# Altium schematic sheet ESP32_Schem_V2.SchDoc (part 4 of 4)
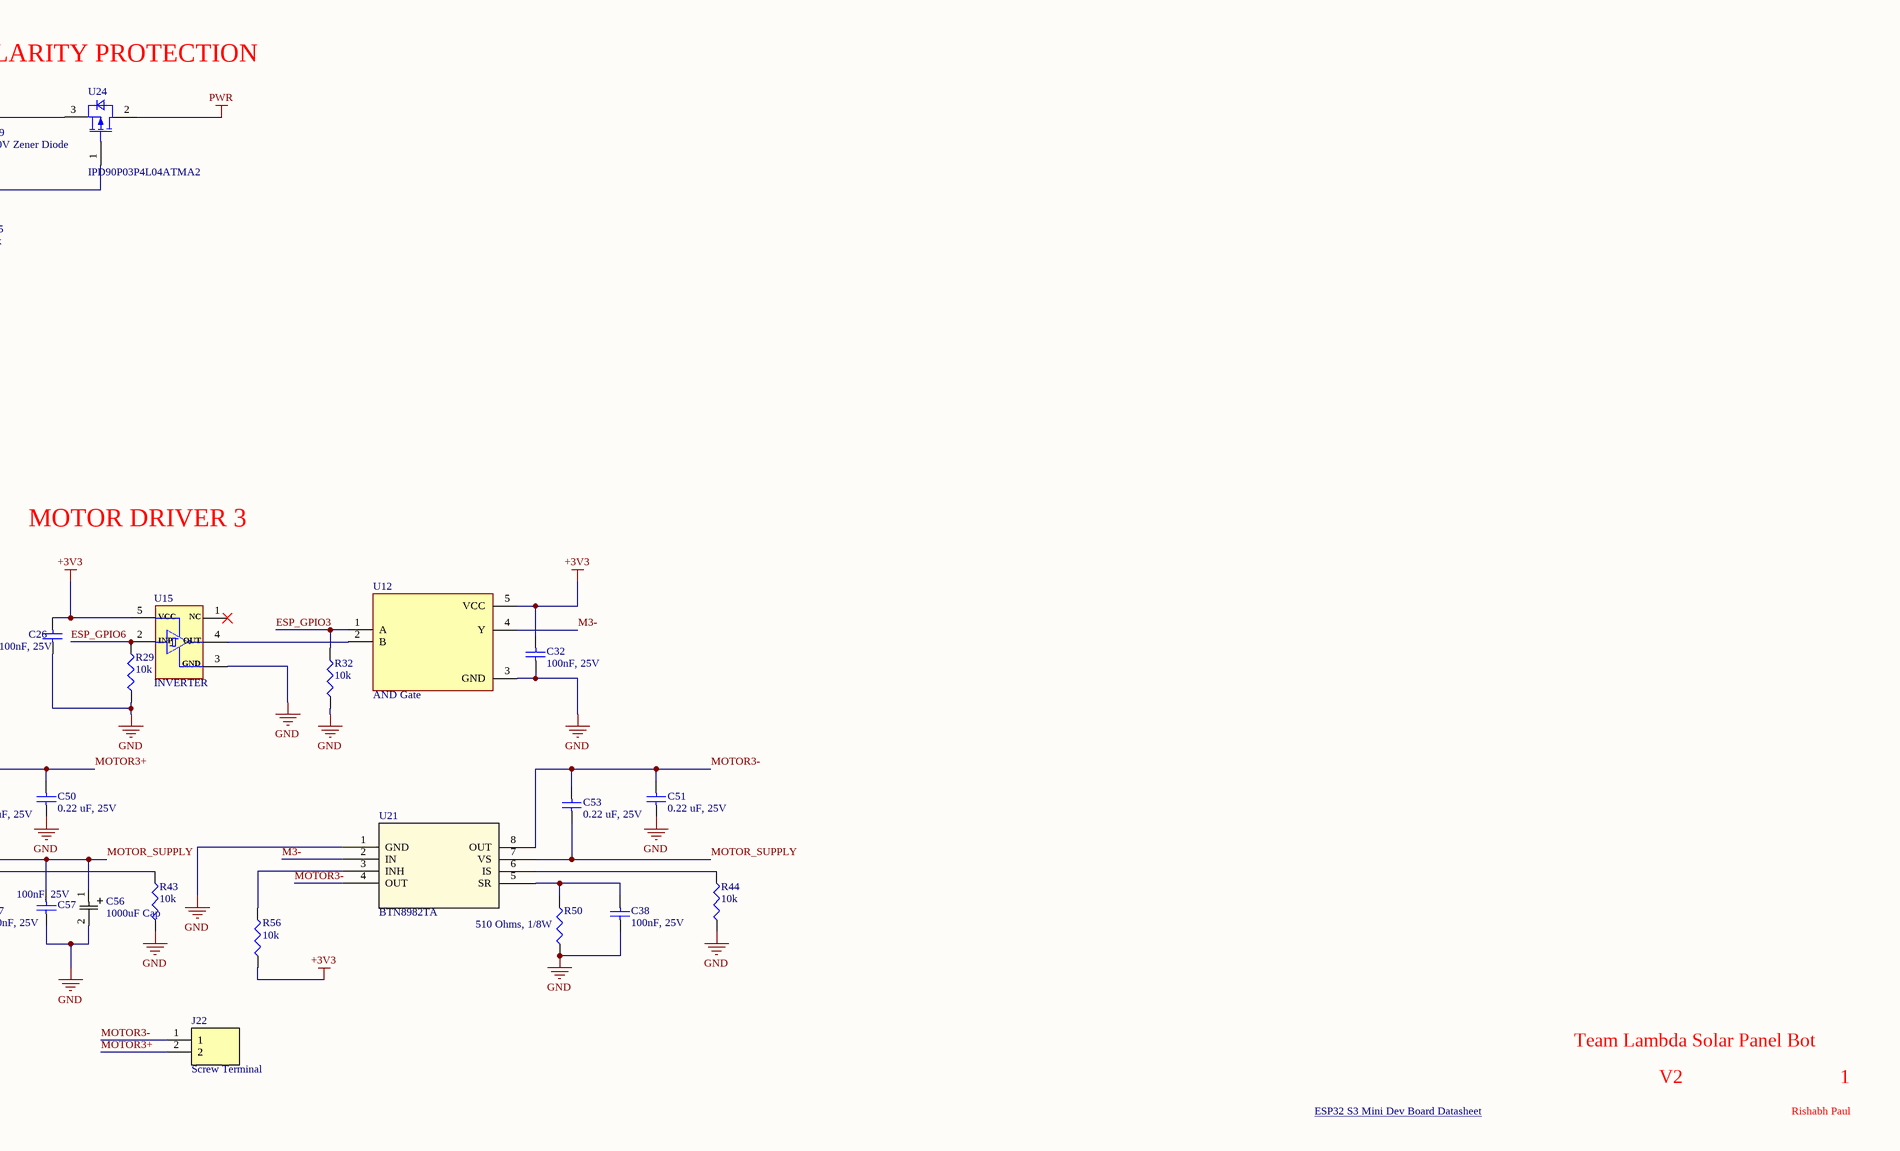
[diagram p6: ESP32_Schem_V2.SchDoc, bottom right]

## Library data of the parts (continued)
R23 R24 = AC0402FR-075K1L: Fixed Resistor, Metal Glaze/thick Film, 0.0625W, 5100ohm, 50V, 1% +/-Tol, 100ppm/Cel, Surface Mount, 0402; Manufacturer: Yageo; Additional Feature: LASER TRIMMABLE; Power: 62.5mW; Rated Temperature: 70°C; Value: 5.1kR; Temperature Coefficient (ppm/Cel): 100; Package Height: 0.32mm; Package Length: 1mm; Package Width: 0.5mm; Reference Standard: AEC-Q200; Supplier: Digikey; Supplier Part Number: YAG3503CT-ND; Manufacturer Part Number: AC0402FR-075K1L; RoHS: Yes; Category: Chip SMD Resistors; Stock: 61301; Pricing: 1=0.1, 10=0.009, 100=0.0071, 1000=0.00612, 2500=0.0051, 10000=0.00204 (USD); Mounting Technology: Surface Mount; Pins: 2; Package Shape: Rectangular; Case/Package: 0402; Terminal Finish: Nickel; Min Operating Temperature: -55°C; Max Operating Temperature: 155°C; Tolerance: 1%; JESD-609 Code: e3; Resistor Type: FIXED RESISTOR; Construction: Chip; Packaging: Tape and Reel; Technology: METAL GLAZE/THICK FILM; Termination: Wraparound; Working Voltage: 50V; Reach SVHC Compliant: Yes; RoHS Compliant: Yes; ComponentLink1URL: https://datasheet.ciiva.com:443/pdfs/VipMasterIC/IC/YAGO/YAGO-S-A0003597364/YAGO-S-A0003597364-1.pdf?src-supplier=IHS+Markit; ComponentLink1Description: https://datasheet.ciiva.com:443/pdfs/VipMasterIC/IC/YAGO/YAGO-S-A0003597364/YAGO-S-A0003597364-1.pdf?src-supplier=IHS+Markit; ComponentLink2URL: https://datasheet.octopart.com/AC0402FR-075K1L-Yageo-datasheet-166720450.pdf?src-supplier=Future+Electronics; ComponentLink2Description: https://datasheet.octopart.com/AC0402FR-075K1L-Yageo-datasheet-166720450.pdf?src-supplier=Future+Electronics; ComponentLink3URL: http://www.yageo.com/documents/recent/PYu-AC_51_RoHS_L_2_revised.pdf?src-supplier=Future+Electronics; ComponentLink3Description: http://www.yageo.com/documents/recent/PYu-AC_51_RoHS_L_2_revised.pdf?src-supplier=Future+Electronics; ComponentLink4URL: http://www.yageo.com/NewPortal/yageodocoutput?fileName=/pdf/R-Chip/PYu-AC_51_RoHS_L_6.pdf&src-supplier=Digikey; ComponentLink4Description: http://www.yageo.com/NewPortal/yageodocoutput?fileName=/pdf/R-Chip/PYu-AC_51_RoHS_L_6.pdf&src-supplier=Digikey; ComponentLink5URL: https://datasheet.octopart.com/AC0402FR-075K1L-Yageo-datasheet-178509465.pdf?src-supplier=Newark; ComponentLink5Description: https://datasheet.octopart.com/AC0402FR-075K1L-Yageo-datasheet-178509465.pdf?src-supplier=Newark; ComponentLink6URL: https://datasheet.octopart.com/AC0402FR-075K1L-Yageo-datasheet-178509465.pdf?src-supplier=Farnell; ComponentLink6Description: https://datasheet.octopart.com/AC0402FR-075K1L-Yageo-datasheet-178509465.pdf?src-supplier=Farnell; ComponentLink7URL: https://datasheet.octopart.com/AC0402FR-075K1L-Yageo-datasheet-178509465.pdf?src-supplier=Element14; ComponentLink7Description: https://datasheet.octopart.com/AC0402FR-075K1L-Yageo-datasheet-178509465.pdf?src-supplier=Element14; LCSC Part Number: C144745
R25 R27-R44 R51-R56 = RC0402FR-0710KP: RES 10K OHM 1% 1/16W 0402; Manufacturer: Yageo; Additional Feature: LASER TRIMMABLE; Power: 62.5mW; Rated Temperature: 70°C; Value: 10kR; Working Voltage: 50V; Temperature Coefficient (ppm/Cel): 150; Supplier: Digikey; Supplier Part Number: YAG1249CT-ND; Manufacturer Part Number: RC0402FR-0710KP; RoHS: Yes; Category: Chip SMD Resistors; Stock: 883590; Pricing: 1=0.11, 10=0.014, 100=0.0112, 1000=0.00918, 2500=0.00714 (USD); Mounting Technology: Surface Mount; Pins: 2; Package Shape: Rectangular; Case/Package: 0402; Terminal Finish: Nickel; Min Operating Temperature: -55°C; Max Operating Temperature: 155°C; Tolerance: 1%; JESD-609 Code: e3; Resistor Type: FIXED RESISTOR; Packaging: Tape and Reel; Technology: METAL GLAZE/THICK FILM; Termination: Wraparound; Reach SVHC Compliant: Yes; RoHS Compliant: Yes; ComponentLink1URL: https://datasheet.ciiva.com:443/pdfs/VipMasterIC/IC/YAGO/YAGO-S-A0006248068/YAGO-S-A0006248068-1.pdf?src-supplier=IHS+Markit; ComponentLink1Description: https://datasheet.ciiva.com:443/pdfs/VipMasterIC/IC/YAGO/YAGO-S-A0006248068/YAGO-S-A0006248068-1.pdf?src-supplier=IHS+Markit; ComponentLink2URL: http://www.yageo.com/NewPortal/yageodocoutput?fileName=/pdf/R-Chip/PYu-RC_51_RoHS_P_0.pdf&src-supplier=Digikey; ComponentLink2Description: http://www.yageo.com/NewPortal/yageodocoutput?fileName=/pdf/R-Chip/PYu-RC_51_RoHS_P_0.pdf&src-supplier=Digikey; ComponentLink3URL: https://datasheet.octopart.com/RC0402FR-0710KP-Yageo-datasheet-165786347.pdf?src-supplier=Future+Electronics; ComponentLink3Description: https://datasheet.octopart.com/RC0402FR-0710KP-Yageo-datasheet-165786347.pdf?src-supplier=Future+Electronics; ComponentLink4URL: https://datasheet.octopart.com/RC0402FR-0710KP-Yageo-datasheet-176147777.pdf?src-supplier=Newark; ComponentLink4Description: https://datasheet.octopart.com/RC0402FR-0710KP-Yageo-datasheet-176147777.pdf?src-supplier=Newark; ComponentLink5URL: https://datasheet.octopart.com/RC0402FR-0710KP-Yageo-datasheet-176147777.pdf?src-supplier=Farnell; ComponentLink5Description: https://datasheet.octopart.com/RC0402FR-0710KP-Yageo-datasheet-176147777.pdf?src-supplier=Farnell; ComponentLink6URL: https://datasheet.octopart.com/RC0402FR-0710KP-Yageo-datasheet-176147777.pdf?src-supplier=Element14; ComponentLink6Description: https://datasheet.octopart.com/RC0402FR-0710KP-Yageo-datasheet-176147777.pdf?src-supplier=Element14; LCSC Part Number: C851816
R45-R50 = RC0805FR-07510RL: RES 510 OHM 1% 1/8W 0805; Manufacturer: Yageo Group; Power Dissipation: 125mW; Value: 510Ω; Temperature Coefficient: 100ppm/°C; Voltage Rating: 150V; Supplier: DigiKey; Supplier Part Number: 311-510CRCT-ND; Manufacturer Part Number: RC0805FR-07510RL; RoHS: Compliant; Category: Chip SMD Resistors; Stock: 812; Pricing: 1=0.1, 10=0.010, 25=0.0092, 50=0.0082, 100=0.0077, 250=0.00712 (USD); Case/Package: 0805; Case Code (Imperial): 0805; China RoHS: Non-Compliant; Composition: Thick Film; Depth: 1.25mm; Height: 500µm; Lead Free: Lead Free; Length: 2mm; Lifecycle Status: Production; Max Operating Temperature: 155°C; Military Standard: Not; Min Operating Temperature: -55°C; Mounting Technology: Surface Mount; Number of Terminals: 2; Packaging: Tape & Reel; Power Rating: 125mW; REACH SVHC: Yes; Schedule B: 8533210045, 8533210045|8533210045, 8533210045|8533210045|8533210045, 8533210045|8533210045|8533210045|8533210045; Termination: SMD/SMT; Tolerance: 1%; Voltage Rating (DC): 150V; Width: 1.25mm; Working Voltage: 150V; ComponentLink1URL: https://datasheet.octopart.com:443/RC0805FR-07510RL-Yageo-datasheet-175887523.pdf?src-supplier=Newark; ComponentLink1Description: https://datasheet.octopart.com:443/RC0805FR-07510RL-Yageo-datasheet-175887523.pdf?src-supplier=Newark; ComponentLink2URL: https://datasheet.octopart.com:443/RC0805FR-07510RL-Yageo-datasheet-103092701.pdf?src-supplier=Upverter; ComponentLink2Description: https://datasheet.octopart.com:443/RC0805FR-07510RL-Yageo-datasheet-103092701.pdf?src-supplier=Upverter; ComponentLink3URL: https://datasheet.octopart.com:443/RC0805FR-07510RL-Yageo-datasheet-8330313.pdf?src-supplier=Burklin+Elektronik; ComponentLink3Description: https://datasheet.octopart.com:443/RC0805FR-07510RL-Yageo-datasheet-8330313.pdf?src-supplier=Burklin+Elektronik; ComponentLink4URL: https://datasheet.octopart.com:443/RC0805FR-07510RL-Yageo-datasheet-176638170.pdf?src-supplier=Farnell; ComponentLink4Description: https://datasheet.octopart.com:443/RC0805FR-07510RL-Yageo-datasheet-176638170.pdf?src-supplier=Farnell; ComponentLink5URL: https://datasheet.octopart.com:443/RC0805FR-07510RL-Yageo-datasheet-164759695.pdf?src-supplier=Future+Electronics; ComponentLink5Description: https://datasheet.octopart.com:443/RC0805FR-07510RL-Yageo-datasheet-164759695.pdf?src-supplier=Future+Electronics; ComponentLink6URL: https://datasheet.octopart.com:443/RC0805FR-07510RL-Yageo-datasheet-127823281.pdf?src-supplier=Future+Electronics; ComponentLink6Description: https://datasheet.octopart.com:443/RC0805FR-07510RL-Yageo-datasheet-127823281.pdf?src-supplier=Future+Electronics; ComponentLink7URL: https://datasheet.octopart.com:443/RC0805FR-07510RL-Yageo-datasheet-137700087.pdf?src-supplier=Future+Electronics; ComponentLink7Description: https://datasheet.octopart.com:443/RC0805FR-07510RL-Yageo-datasheet-137700087.pdf?src-supplier=Future+Electronics; ComponentLink8URL: https://datasheet.octopart.com:443/RC0805FR-07510RL-Yageo-datasheet-12592811.pdf?src-supplier=Future+Electronics; ComponentLink8Description: https://datasheet.octopart.com:443/RC0805FR-07510RL-Yageo-datasheet-12592811.pdf?src-supplier=Future+Electronics; ComponentLink9URL: https://datasheet.octopart.com:443/RC0805FR-07510RL-Yageo-datasheet-8324252.pdf?src-supplier=Future+Electronics; ComponentLink9Description: https://datasheet.octopart.com:443/RC0805FR-07510RL-Yageo-datasheet-8324252.pdf?src-supplier=Future+Electronics; ComponentLink10URL: https://datasheet.octopart.com/RC0805FR-07510RL-Yageo-datasheet-73766026.pdf; ComponentLink10Description: https://datasheet.octopart.com/RC0805FR-07510RL-Yageo-datasheet-73766026.pdf; ComponentLink11URL: https://datasheet.octopart.com:443/RC0805FR-07510RL-Yageo-datasheet-118657.pdf?src-supplier=DigiKey; ComponentLink11Description: https://datasheet.octopart.com:443/RC0805FR-07510RL-Yageo-datasheet-118657.pdf?src-supplier=DigiKey; ComponentLink12URL: http://sigma.octopart.com:80/conflict_mineral_statement/Yageo-company-3.pdf?src-supplier=Compliance+Statements; ComponentLink12Description: http://sigma.octopart.com:80/conflict_mineral_statement/Yageo-company-3.pdf?src-supplier=Compliance+Statements; ComponentLink13URL: http://sigma.octopart.com:80/rohs_statement/Yageo-company-2.pdf?src-supplier=Compliance+Statements; ComponentLink13Description: http://sigma.octopart.com:80/rohs_statement/Yageo-company-2.pdf?src-supplier=Compliance+Statements; LCSC Part Number: C114563
SW2 SW3 = PTS645SH50SMTR92LFS: Keypad Switch, 1 Switches, SPST, Momentary-tactile, 0.05A, 12VDC, 1.96N, 4 PCB Hole Cnt, Solder Terminal, Surface Mount-straight; Manufacturer: ITT C&K; Manufacturer Series: PTS645; Actuator Type: Pushbutton; Contact Current(DC)-Max: 50mA; Contact DC Max Rating R Load: 0.05A@12VDC; Contact Resistance: 0.1mR; Contact Voltage(DC)-Max: 12V; Dielectric Withstand Volts: 250VACV; Insulation Resistance: 100GR; PCB Hole Count: 4; Body Breadth: 5.9944mm; Body Height: 3.4544mm; Supplier: Digikey; Supplier Part Number: CKN9085CT-ND; Manufacturer Part Number: PTS645SH50SMTR92LFS; RoHS: Yes; Category: Tactile Switches; Stock: 18843; Pricing: 1=0.35, 10=0.3, 25=0.2804, 100=0.251, 250=0.23256, 500=0.21948 (USD); Mounting Technology: Surface Mount; Terminal Finish: Silver; Min Operating Temperature: -20°C; Max Operating Temperature: 60°C; JESD-609 Code: e4; Switch Action: MOMENTARY; Switch Function: SPST; Switch Type: Keypad; Termination: Solder; Body Length or Diameter: 5.9944mm; Terminal Length: 0.138inch; Reach SVHC Compliant: Yes; RoHS Compliant: Yes; ComponentLink1URL: https://datasheet.ciiva.com:443/pdfs/VipMasterIC/IC/CKCI/CKCI-S-A0001796527/CKCI-S-A0001796842-1.pdf?src-supplier=IHS+Markit; ComponentLink1Description: https://datasheet.ciiva.com:443/pdfs/VipMasterIC/IC/CKCI/CKCI-S-A0001796527/CKCI-S-A0001796842-1.pdf?src-supplier=IHS+Markit; ComponentLink2URL: https://datasheet.ciiva.com/29903/getdatasheetpartid-773702-29903807.pdf?src-supplier=Verical; ComponentLink2Description: https://datasheet.ciiva.com/29903/getdatasheetpartid-773702-29903807.pdf?src-supplier=Verical; ComponentLink3URL: https://datasheet.ciiva.com/14920/pts645-14920741.pdf?src-supplier=Digikey; ComponentLink3Description: https://datasheet.ciiva.com/14920/pts645-14920741.pdf?src-supplier=Digikey; ComponentLink4URL: https://datasheet.ciiva.com/22637/1707731-22637356.pdf?src-supplier=Element14; ComponentLink4Description: https://datasheet.ciiva.com/22637/1707731-22637356.pdf?src-supplier=Element14; LCSC Part Number: C221869
U1 = TPS563209DDCR: IC REG BUCK ADJ 3A SOT23; Manufacturer: Texas Instruments; Package Body Material: Plastic; Throw Configuration: SWITCHING REGULATOR; Control Technique: PULSE WIDTH MODULATION; Max Supply Voltage: 17V; Min Input Voltage: 4.5V; Nominal Supply Voltage: 12V; Channels: 1; Max Output current: 5.3A; Frequency: 650kHz; Supplier: Digikey; Supplier Part Number: 296-40813-1-ND; Manufacturer Part Number: TPS563209DDCR; RoHS: Yes; Category: Voltage Regulators - Switching; Stock: 3662; Pricing: 1=0.9, 10=0.643, 25=0.5796, 100=0.5095, 250=0.47608, 500=0.45596, 1000=0.43938 (USD); Case/Package: TSSOP; Pins: 6; Package Shape: Rectangular; Terminal Finish: Tin; Min Operating Temperature: -40°C; Max Operating Temperature: 85°C; JESD-609 Code: e3; JESD-30 Code: R-PDSO-G6; Moisture Sensitivity Level: 1; Package Style: SMALL OUTLINE, THIN PROFILE, SHRINK PITCHMeter; Peak Reflow Temperature (Cel): 260°C; Surface Mount: Yes; Switcher Configuration: BUCK; Terminal Form: Gull Wing; Terminal Position: DUAL; Length: 2.9mm; Width: 1.6mm; Height - Seated (Max): 1.1mm; Terminal Pitch: 0.95mm; Temperature Grade: INDUSTRIAL; Reach SVHC Compliant: Yes; RoHS Compliant: Yes; ComponentLink1URL: https://www.ti.com:443/lit/ds/symlink/tps562209.pdf?src-supplier=IHS+Markit; ComponentLink1Description: https://www.ti.com:443/lit/ds/symlink/tps562209.pdf?src-supplier=IHS+Markit; ComponentLink2URL: http://www.ti.com/general/docs/lit/getliterature.tsp?genericPartNumber=TPS562209&&fileType=pdf&src-supplier=Avnet; ComponentLink2Description: http://www.ti.com/general/docs/lit/getliterature.tsp?genericPartNumber=TPS562209&&fileType=pdf&src-supplier=Avnet; ComponentLink3URL: http://www.ti.com/general/docs/suppproductinfo.tsp?distId=10&amp;gotoUrl=http%3A%2F%2Fwww.ti.com%2Flit%2Fgpn%2Ftps563209&src-supplier=Digikey; ComponentLink3Description: http://www.ti.com/general/docs/suppproductinfo.tsp?distId=10&amp;gotoUrl=http%3A%2F%2Fwww.ti.com%2Flit%2Fgpn%2Ftps563209&src-supplier=Digikey; ComponentLink4URL: http://www.ti.com/lit/ds/symlink/tps563209.pdf?src-supplier=Digikey; ComponentLink4Description: http://www.ti.com/lit/ds/symlink/tps563209.pdf?src-supplier=Digikey; ComponentLink5URL: http://www.ti.com/lit/gpn/tps563209?src-supplier=Mouser; ComponentLink5Description: http://www.ti.com/lit/gpn/tps563209?src-supplier=Mouser; LCSC Part Number: C181974
U3 = TL1963A-33DCYR: Fixed Positive LDO Regulator, 3.3V, 0.55V Dropout, BIPolar, PDSO4; Manufacturer: Texas Instruments; Package Body Material: Plastic; Dropout Voltage1-Max: 550mV; Dropout Voltage1-Nom: 340mV; Input Voltage Absolute-Max: 20V; Min Input Voltage: 3.8V; Channels: 1; Output Current1-Max: 1.5A; Output Voltage1-Max: 3.4V; Output Voltage1-Min: 3.2V; Regulator Type: FIXED POSITIVE SINGLE OUTPUT LDO REGULATOR; Voltage Tolerance-Max: 3%; Qualification Status: Not Qualified; Supplier: Digikey; Supplier Part Number: 296-24897-1-ND; Manufacturer Part Number: TL1963A-33DCYR; RoHS: Yes; Category: Voltage Regulators - Linear; Stock: 2146; Pricing: 1=2.76, 10=2.062, 25=1.8864, 100=1.6934, 250=1.60148, 500=1.54604, 1000=1.50041 (USD); Case/Package: SOP; Pins: 4; Package Shape: Rectangular; Terminal Finish: Tin; JESD-609 Code: e3; Adjustability: FIXED; Max Supply Voltage: 20V; JESD-30 Code: R-PDSO-G4; Moisture Sensitivity Level: 2; Number of Outputs: 1; Operating Temperature, TJ-Max: 125°C; Operating Temperature, TJ-Min: -40°C; Output Voltage1-Nom: 3.3V; Packaging: Tape and Reel; Peak Reflow Temperature (Cel): 260°C; Surface Mount: Yes; Technology: BIPOLAR; Terminal Form: Gull Wing; Terminal Position: DUAL; Length: 6.5mm; Width: 3.5mm; Height - Seated (Max): 1.8mm; Terminal Pitch: 2.3mm; Reach SVHC Compliant: Yes; RoHS Compliant: Yes; ComponentLink1URL: https://www.ti.com:443/lit/ds/symlink/tl1963a.pdf?src-supplier=IHS+Markit; ComponentLink1Description: https://www.ti.com:443/lit/ds/symlink/tl1963a.pdf?src-supplier=IHS+Markit; ComponentLink2URL: https://datasheet.ciiva.com/2046/-2046068.pdf?src-supplier=Digikey; ComponentLink2Description: https://datasheet.ciiva.com/2046/-2046068.pdf?src-supplier=Digikey; LCSC Part Number: C181262
U4 = FT231XQ-R: IC USB SERIAL FULL UART 20QFN; Manufacturer: FTDI; Power Supplies: 3.3/5V; Max Supply Current: 8.4mA; Max Supply Voltage: 5.5V; Min Supply Voltage: 2.97V; Nominal Supply Voltage: 5V; Qualification Status: Not Qualified; Supplier: Digikey; Supplier Part Number: 768-1128-1-ND; Manufacturer Part Number: FT231XQ-R; RoHS: Yes; Category: Interface ICs; Stock: 27195; Pricing: 1=2.34, 25=2.27, 100=2.2, 250=2, 500=1.82002, 1000=1.7625 (USD); Case/Package: HVQCCN; Pins: 20; Package Shape: Square; Min Operating Temperature: -40°C; Max Operating Temperature: 85°C; JESD-30 Code: S-XQCC-N20; Package Style: CHIP CARRIER, HEAT SINK/SLUG, VERY THIN PROFILEMeter; Surface Mount: Yes; Technology: CMOS; Terminal Form: No Lead; Terminal Position: QUAD; Length: 4mm; Width: 4mm; Height - Seated (Max): 0.8mm; Terminal Pitch: 0.5mm; Temperature Grade: INDUSTRIAL; Reach SVHC Compliant: Yes; RoHS Compliant: Yes; ComponentLink1URL: https://datasheet.ciiva.com:443/pdfs/VipMasterIC/IC/FTDI/FTDIS00099/FTDIS00099-1.pdf?src-supplier=IHS+Markit; ComponentLink1Description: https://datasheet.ciiva.com:443/pdfs/VipMasterIC/IC/FTDI/FTDIS00099/FTDIS00099-1.pdf?src-supplier=IHS+Markit; ComponentLink2URL: https://datasheet.ciiva.com/1787/ds-ft231x-1787312.pdf?src-supplier=Digikey; ComponentLink2Description: https://datasheet.ciiva.com/1787/ds-ft231x-1787312.pdf?src-supplier=Digikey; ComponentLink3URL: https://datasheet.ciiva.com/4787/ds-ft231x-13571-4787570.pdf?src-supplier=Mouser; ComponentLink3Description: https://datasheet.ciiva.com/4787/ds-ft231x-13571-4787570.pdf?src-supplier=Mouser; ComponentLink4URL: https://datasheet.ciiva.com/30475/0900766b811020d3-30475405.pdf?src-supplier=Rs; ComponentLink4Description: https://datasheet.ciiva.com/30475/0900766b811020d3-30475405.pdf?src-supplier=Rs; ComponentLink5URL: https://datasheet.ciiva.com/1787/ft-x-series-1787313.pdf?src-supplier=Digikey; ComponentLink5Description: https://datasheet.ciiva.com/1787/ft-x-series-1787313.pdf?src-supplier=Digikey; ComponentLink6URL: https://datasheet.ciiva.com/1787/ft-x-series-1787314.pdf?src-supplier=Digikey; ComponentLink6Description: https://datasheet.ciiva.com/1787/ft-x-series-1787314.pdf?src-supplier=Digikey; LCSC Part Number: C132159
U7-U12 = SN74LVC1G08DBVR: IC GATE AND 1CH 2-INP SOT23-5; Manufacturer: Texas Instruments; Manufacturer Lifecycle Status: ACTIVE; High Level Output Current: -32mA; Low Level Output Current: 32mA; Max Supply Voltage: 5.5V; Min Supply Voltage: 1.65V; Number of Bits: 1; Number of Input Lines: 2; Propagation Delay: 4ns; Quiescent Current: 10µA; Turn-On Delay Time: 4.5ns; Supplier: DigiKey; Supplier Part Number: 296-11601-1-ND; Manufacturer Part Number: SN74LVC1G08DBVR; RoHS: Compliant; Category: Logic Gates; Stock: 162078; Pricing: 1=0.1, 10=0.067, 25=0.0584, 100=0.049, 250=0.04456, 500=0.04184, 1000=0.03962 (USD); Case/Package: SOT-23; Contact Plating: Gold; Height: 1.45mm; Lead Free: Lead Free; Length: 2.9mm; Lifecycle Status: Production; Logic Function: AND; Max Operating Temperature: 125°C; Max Output current: 32mA; Min Operating Temperature: -40°C; Mounting Technology: Surface Mount; Number of Channels: 1; Number of Circuits: 1; Number of Elements: 1; Number of Gates: 1; Number of Inputs: 2; Number of Output Lines: 1; Number of Outputs: 1; Pins: 5; Output Current: 32mA; Packaging: Cut Tape; Radiation Hardening: No; REACH SVHC: No; Schedule B: 8542390000, 8542390000|8542390000|8542390000|8542390000|8542390000|8542390000|8542390000|8542390000|8542390000|8542390000|8542390000|8542390000|8542390000|8542390000|8542390000|8542390000|8542390000|8542390000|8542390000|8542390000|8542390000|8542390000|8542390000|85; Termination: SMD/SMT; Thickness: 1.2mm; Weight: 15.790684mg; Width: 1.6mm; ComponentLink1URL: https://sigma.octopart.com:443/177332311/technical_drawing/Texas-Instruments-SN74LVC1G08DBVR.pdf?src-supplier=Texas+Instruments; ComponentLink1Description: https://sigma.octopart.com:443/177332311/technical_drawing/Texas-Instruments-SN74LVC1G08DBVR.pdf?src-supplier=Texas+Instruments; ComponentLink2URL: https://octopart.com:443/opatz8j6/c1?t=luKEre2yp-U41BkXgXO6nlf-TzDgG9B9v9puM2cZ102enj5LHPLB-KEWrYj_Bu0f9ErGI3LWLZbm-cx1Ix-XaD7Nvi-PZ_x8bh_09CLFBDU_KqAnDcI2ZMfqnc2GTvjIAW_cOOxWAT1e3tAjtKxTStVCo7RQaBKnDCnT8DGfgRmTVmFO__5EuauwAhVVIMvzG-AN8o0jEeeHbgrYVx7cpxrAydPFA8VIlZnj4BG8VOLcepmYl2s00WbCSdQ_Y_yAMMkDZRS4Ah-Z6Uhj9mqYE6X36BGtAtN2vQ3MX2wWsiyjhUYHtXW2nFa1tb6v9S57VAUejmlQ8e5bWb9kFY8GhAJw_x71AtgzwLSu1OvXq7eEMOgmrPb5dLbZW6l-Z8A7_0HGYdI58w&src-supplier=Texas+Instruments; ComponentLink2Description: https://octopart.com:443/opatz8j6/c1?t=luKEre2yp-U41BkXgXO6nlf-TzDgG9B9v9puM2cZ102enj5LHPLB-KEWrYj_Bu0f9ErGI3LWLZbm-cx1Ix-XaD7Nvi-PZ_x8bh_09CLFBDU_KqAnDcI2ZMfqnc2GTvjIAW_cOOxWAT1e3tAjtKxTStVCo7RQaBKnDCnT8DGfgRmTVmFO__5EuauwAhVVIMvzG-AN8o0jEeeHbgrYVx7cpxrAydPFA8VIlZnj4BG8VOLcepmYl2s00WbCSdQ_Y_yAMMkDZRS4Ah-Z6Uhj9mqYE6X36BGtAtN2vQ3MX2wWsiyjhUYHtXW2nFa1tb6v9S57VAUejmlQ8e5bWb9kFY8GhAJw_x71AtgzwLSu1OvXq7eEMOgmrPb5dLbZW6l-Z8A7_0HGYdI58w&src-supplier=Texas+Instruments; ComponentLink3URL: https://sigma.octopart.com:443/175570406/technical_drawing/Texas-Instruments-SN74LVC1G08DBVR.pdf?src-supplier=Texas+Instruments; ComponentLink3Description: https://sigma.octopart.com:443/175570406/technical_drawing/Texas-Instruments-SN74LVC1G08DBVR.pdf?src-supplier=Texas+Instruments; ComponentLink4URL: https://sigma.octopart.com:443/169406034/technical_drawing/Texas-Instruments-SN74LVC1G08DBVR.pdf?src-supplier=Texas+Instruments; ComponentLink4Description: https://sigma.octopart.com:443/169406034/technical_drawing/Texas-Instruments-SN74LVC1G08DBVR.pdf?src-supplier=Texas+Instruments; ComponentLink5URL: https://sigma.octopart.com:443/155939316/technical_drawing/Texas-Instruments-SN74LVC1G08DBVR.pdf?src-supplier=Texas+Instruments; ComponentLink5Description: https://sigma.octopart.com:443/155939316/technical_drawing/Texas-Instruments-SN74LVC1G08DBVR.pdf?src-supplier=Texas+Instruments; ComponentLink6URL: https://sigma.octopart.com:443/102331370/technical_drawing/Texas-Instruments-SN74LVC1G08DBVR.pdf?src-supplier=Texas+Instruments; ComponentLink6Description: https://sigma.octopart.com:443/102331370/technical_drawing/Texas-Instruments-SN74LVC1G08DBVR.pdf?src-supplier=Texas+Instruments; ComponentLink7URL: https://sigma.octopart.com:443/49249325/technical_drawing/Texas-Instruments-SN74LVC1G08DBVR.pdf?src-supplier=Texas+Instruments; ComponentLink7Description: https://sigma.octopart.com:443/49249325/technical_drawing/Texas-Instruments-SN74LVC1G08DBVR.pdf?src-supplier=Texas+Instruments; ComponentLink8URL: https://datasheet.octopart.com:443/SN74LVC1G08DBVR-Texas-Instruments-datasheet-24998027.pdf?src-supplier=Texas+Instruments; ComponentLink8Description: https://datasheet.octopart.com:443/SN74LVC1G08DBVR-Texas-Instruments-datasheet-24998027.pdf?src-supplier=Texas+Instruments; ComponentLink9URL: https://datasheet.octopart.com:443/SN74LVC1G08DBVR-Texas-Instruments-datasheet-24565349.pdf?src-supplier=Texas+Instruments; ComponentLink9Description: https://datasheet.octopart.com:443/SN74LVC1G08DBVR-Texas-Instruments-datasheet-24565349.pdf?src-supplier=Texas+Instruments; ComponentLink10URL: https://datasheet.octopart.com:443/SN74LVC1G08DBVR-Texas-Instruments-datasheet-16617161.pdf?src-supplier=Texas+Instruments; ComponentLink10Description: https://datasheet.octopart.com:443/SN74LVC1G08DBVR-Texas-Instruments-datasheet-16617161.pdf?src-supplier=Texas+Instruments; ComponentLink11URL: https://datasheet.octopart.com:443/SN74LVC1G08DBVR-Texas-Instruments-datasheet-13075403.pdf?src-supplier=Texas+Instruments; ComponentLink11Description: https://datasheet.octopart.com:443/SN74LVC1G08DBVR-Texas-Instruments-datasheet-13075403.pdf?src-supplier=Texas+Instruments; ComponentLink12URL: https://datasheet.octopart.com:443/SN74LVC1G08DBVR-Texas-Instruments-datasheet-10899415.pdf?src-supplier=Texas+Instruments; ComponentLink12Description: https://datasheet.octopart.com:443/SN74LVC1G08DBVR-Texas-Instruments-datasheet-10899415.pdf?src-supplier=Texas+Instruments; ComponentLink13URL: https://datasheet.octopart.com:443/SN74LVC1G08DBVR-Texas-Instruments-datasheet-10670178.pdf?src-supplier=Texas+Instruments; ComponentLink13Description: https://datasheet.octopart.com:443/SN74LVC1G08DBVR-Texas-Instruments-datasheet-10670178.pdf?src-supplier=Texas+Instruments; ComponentLink14URL: https://datasheet.octopart.com:443/SN74LVC1G08DBVR-Texas-Instruments-datasheet-152892.pdf?src-supplier=Texas+Instruments; ComponentLink14Description: https://datasheet.octopart.com:443/SN74LVC1G08DBVR-Texas-Instruments-datasheet-152892.pdf?src-supplier=Texas+Instruments; ComponentLink15URL: https://datasheet.octopart.com:443/SN74LVC1G08DBVR-Texas-Instruments-datasheet-17022304.pdf?src-supplier=Upverter; ComponentLink15Description: https://datasheet.octopart.com:443/SN74LVC1G08DBVR-Texas-Instruments-datasheet-17022304.pdf?src-supplier=Upverter; ComponentLink16URL: https://datasheet.octopart.com:443/SN74LVC1G08DBVR-Texas-Instruments-datasheet-65713478.pdf?src-supplier=Newark; ComponentLink16Description: https://datasheet.octopart.com:443/SN74LVC1G08DBVR-Texas-Instruments-datasheet-65713478.pdf?src-supplier=Newark; ComponentLink17URL: https://datasheet.octopart.com:443/SN74LVC1G08DBVR-Texas-Instruments-datasheet-11537503.pdf?src-supplier=Newark; ComponentLink17Description: https://datasheet.octopart.com:443/SN74LVC1G08DBVR-Texas-Instruments-datasheet-11537503.pdf?src-supplier=Newark; ComponentLink18URL: https://datasheet.octopart.com:443/SN74LVC1G08DBVR-Texas-Instruments-datasheet-33010996.pdf?src-supplier=Newark; ComponentLink18Description: https://datasheet.octopart.com:443/SN74LVC1G08DBVR-Texas-Instruments-datasheet-33010996.pdf?src-supplier=Newark; ComponentLink19URL: https://datasheet.octopart.com:443/SN74LVC1G08DBVR-Texas-Instruments-datasheet-21259348.pdf?src-supplier=Farnell; ComponentLink19Description: https://datasheet.octopart.com:443/SN74LVC1G08DBVR-Texas-Instruments-datasheet-21259348.pdf?src-supplier=Farnell; ComponentLink20URL: https://datasheet.octopart.com:443/SN74LVC1G08DBVR.-Texas-Instruments-datasheet-37730440.pdf?src-supplier=Farnell; ComponentLink20Description: https://datasheet.octopart.com:443/SN74LVC1G08DBVR.-Texas-Instruments-datasheet-37730440.pdf?src-supplier=Farnell; ComponentLink21URL: https://datasheet.octopart.com:443/SN74LVC1G08DBVR-Texas-Instruments-datasheet-14721140.pdf?src-supplier=Farnell; ComponentLink21Description: https://datasheet.octopart.com:443/SN74LVC1G08DBVR-Texas-Instruments-datasheet-14721140.pdf?src-supplier=Farnell; ComponentLink22URL: https://datasheet.octopart.com:443/SN74LVC1G08DBVR-Texas-Instruments-datasheet-10921153.pdf?src-supplier=Farnell; ComponentLink22Description: https://datasheet.octopart.com:443/SN74LVC1G08DBVR-Texas-Instruments-datasheet-10921153.pdf?src-supplier=Farnell; ComponentLink23URL: https://datasheet.octopart.com:443/SN74LVC1G08DBVR-Texas-Instruments-datasheet-525501.pdf?src-supplier=Farnell; ComponentLink23Description: https://datasheet.octopart.com:443/SN74LVC1G08DBVR-Texas-Instruments-datasheet-525501.pdf?src-supplier=Farnell; ComponentLink24URL: https://datasheet.octopart.com:443/SN74LVC1G08DBVR-Texas-Instruments-datasheet-7555563.pdf?src-supplier=Farnell; ComponentLink24Description: https://datasheet.octopart.com:443/SN74LVC1G08DBVR-Texas-Instruments-datasheet-7555563.pdf?src-supplier=Farnell; ComponentLink25URL: https://datasheet.octopart.com:443/SN74LVC1G08DBVR.-Texas-Instruments-datasheet-59163483.pdf?src-supplier=element14+APAC; ComponentLink25Description: https://datasheet.octopart.com:443/SN74LVC1G08DBVR.-Texas-Instruments-datasheet-59163483.pdf?src-supplier=element14+APAC; ComponentLink26URL: https://datasheet.octopart.com:443/SN74LVC1G08DBVR-Texas-Instruments-datasheet-26576919.pdf?src-supplier=element14+APAC; ComponentLink26Description: https://datasheet.octopart.com:443/SN74LVC1G08DBVR-Texas-Instruments-datasheet-26576919.pdf?src-supplier=element14+APAC; ComponentLink27URL: https://datasheet.octopart.com:443/SN74LVC1G08DBVR-Texas-Instruments-datasheet-23768626.pdf?src-supplier=element14+APAC; ComponentLink27Description: https://datasheet.octopart.com:443/SN74LVC1G08DBVR-Texas-Instruments-datasheet-23768626.pdf?src-supplier=element14+APAC; ComponentLink28URL: https://datasheet.octopart.com:443/SN74LVC1G08DBVR-Texas-Instruments-datasheet-21418265.pdf?src-supplier=element14+APAC; ComponentLink28Description: https://datasheet.octopart.com:443/SN74LVC1G08DBVR-Texas-Instruments-datasheet-21418265.pdf?src-supplier=element14+APAC; ComponentLink29URL: https://datasheet.octopart.com:443/SN74LVC1G08DBVR..-Texas-Instruments-datasheet-557649.pdf?src-supplier=element14; ComponentLink29Description: https://datasheet.octopart.com:443/SN74LVC1G08DBVR..-Texas-Instruments-datasheet-557649.pdf?src-supplier=element14; ComponentLink30URL: https://datasheet.octopart.com:443/SN74LVC1G08DBVR-Texas-Instruments-datasheet-8548809.pdf?src-supplier=element14; ComponentLink30Description: https://datasheet.octopart.com:443/SN74LVC1G08DBVR-Texas-Instruments-datasheet-8548809.pdf?src-supplier=element14; ComponentLink31URL: https://datasheet.octopart.com:443/SN74LVC1G08DBVR-Texas-Instruments-datasheet-5364345.pdf?src-supplier=element14; ComponentLink31Description: https://datasheet.octopart.com:443/SN74LVC1G08DBVR-Texas-Instruments-datasheet-5364345.pdf?src-supplier=element14; ComponentLink32URL: https://datasheet.octopart.com:443/SN74LVC1G08DBVR-Texas-Instruments-datasheet-18676.pdf?src-supplier=DigiKey; ComponentLink32Description: https://datasheet.octopart.com:443/SN74LVC1G08DBVR-Texas-Instruments-datasheet-18676.pdf?src-supplier=DigiKey; ComponentLink33URL: https://datasheet.octopart.com:443/SN74LVC1G08DBVR-Texas-Instruments-datasheet-160672334.pdf?src-supplier=LCSC; ComponentLink33Description: https://datasheet.octopart.com:443/SN74LVC1G08DBVR-Texas-Instruments-datasheet-160672334.pdf?src-supplier=LCSC; ComponentLink34URL: https://datasheet.octopart.com:443/SN74LVC1G08DBVR-Texas-Instruments-datasheet-159116632.pdf?src-supplier=LCSC; ComponentLink34Description: https://datasheet.octopart.com:443/SN74LVC1G08DBVR-Texas-Instruments-datasheet-159116632.pdf?src-supplier=LCSC; ComponentLink35URL: https://datasheet.octopart.com:443/SN74LVC1G08DBVR-Texas-Instruments-datasheet-151312774.pdf?src-supplier=SHENGYU+ELECTRONICS; ComponentLink35Description: https://datasheet.octopart.com:443/SN74LVC1G08DBVR-Texas-Instruments-datasheet-151312774.pdf?src-supplier=SHENGYU+ELECTRONICS; ComponentLink36URL: https://datasheet.octopart.com:443/SN74LVC1G08DBVR-Texas-Instruments-datasheet-48051189.pdf?src-supplier=TME; ComponentLink36Description: https://datasheet.octopart.com:443/SN74LVC1G08DBVR-Texas-Instruments-datasheet-48051189.pdf?src-supplier=TME; ComponentLink37URL: https://datasheet.octopart.com:443/SN74LVC1G08DBVR-Texas-Instruments-datasheet-137316104.pdf?src-supplier=Future+Electronics; ComponentLink37Description: https://datasheet.octopart.com:443/SN74LVC1G08DBVR-Texas-Instruments-datasheet-137316104.pdf?src-supplier=Future+Electronics; ComponentLink38URL: https://datasheet.octopart.com:443/SN74LVC1G08DBVR-Texas-Instruments-datasheet-14147268.pdf?src-supplier=iiiC; ComponentLink38Description: https://datasheet.octopart.com:443/SN74LVC1G08DBVR-Texas-Instruments-datasheet-14147268.pdf?src-supplier=iiiC; ComponentLink39URL: https://datasheet.octopart.com:443/SN74LVC1G08DBVR-Texas-Instruments-datasheet-8321668.pdf?src-supplier=Jameco; ComponentLink39Description: https://datasheet.octopart.com:443/SN74LVC1G08DBVR-Texas-Instruments-datasheet-8321668.pdf?src-supplier=Jameco; ComponentLink40URL: https://datasheet.octopart.com:443/SN74LVC1G08DBVR-Texas-Instruments-datasheet-112445.pdf?src-supplier=Sierra+IC; ComponentLink40Description: https://datasheet.octopart.com:443/SN74LVC1G08DBVR-Texas-Instruments-datasheet-112445.pdf?src-supplier=Sierra+IC; ComponentLink41URL: http://sigma.octopart.com:80/reach_statement/Texas-Instruments-company-64.pdf?src-supplier=Compliance+Statements; ComponentLink41Description: http://sigma.octopart.com:80/reach_statement/Texas-Instruments-company-64.pdf?src-supplier=Compliance+Statements; ComponentLink42URL: http://sigma.octopart.com:80/conflict_mineral_statement/Texas-Instruments-company-63.pdf?src-supplier=Compliance+Statements; ComponentLink42Description: http://sigma.octopart.com:80/conflict_mineral_statement/Texas-Instruments-company-63.pdf?src-supplier=Compliance+Statements; LCSC Part Number: C7666
U13-U15 = SN74AHC1G14DBVR: Inverter IC 1 Channel Schmitt Trigger SOT-23-5; Manufacturer: Texas Instruments; Manufacturer Lifecycle Status: ACTIVE; High Level Output Current: -8mA; Logic Function: Inverting; Low Level Output Current: 8mA; Max Junction Temperature (Tj): 150°C; Max Supply Voltage: 5.5V; Min Supply Voltage: 2V; Number of Bits: 1; Propagation Delay: 10.6ns; Quiescent Current: 1µA; Schmitt Trigger Input: Yes; Turn-On Delay Time: 18.5ns; Supplier: DigiKey; Supplier Part Number: 296-1092-1-ND; Manufacturer Part Number: SN74AHC1G14DBVR; RoHS: Compliant; Category: Logic Gates; Stock: 241421; Pricing: 1=0.12, 10=0.082, 25=0.0716, 100=0.0602, 250=0.05484, 500=0.05162, 1000=0.04896 (USD); Ambient Temperature Range High: 125°C; Case/Package: SOT-23; Contact Plating: Tin; Height: 1.45mm; Lead Free: Lead Free; Length: 2.9mm; Lifecycle Status: Production; Max Operating Temperature: 125°C; Max Output current: 8mA; Min Operating Temperature: -40°C; Mounting Technology: Surface Mount; Number of Channels: 1; Number of Circuits: 1; Number of Elements: 1; Number of Gates: 1; Number of Inputs: 1; Number of Outputs: 1; Pins: 5; Output Current: 8mA; Packaging: Cut Tape; Radiation Hardening: No; REACH SVHC: No; Schedule B: 8542390000, 8542390000|8542390000|8542390000|8542390000|8542390000; Termination: SMD/SMT; Thickness: 1.2mm; Weight: 15.790684mg; Width: 1.6mm; ComponentLink1URL: https://sigma.octopart.com:443/177332311/technical_drawing/Texas-Instruments-SN74AHC1G14DBVR.pdf?src-supplier=Texas+Instruments; ComponentLink1Description: https://sigma.octopart.com:443/177332311/technical_drawing/Texas-Instruments-SN74AHC1G14DBVR.pdf?src-supplier=Texas+Instruments; ComponentLink2URL: https://octopart.com:443/opatz8j6/c1?t=F1xmG4FY8E4vrhjZrryjc23mCPIq81FSY47YbdUgzrOHKtatYtzBXjfTcUeFnRUOhXhk7ehRXLThSk6nTVP-yByxdkTK7GVS62bmswlM-KDnmEI1Oz3fC9QaPI8rEX43L1-nlQ88I0DH8vF85ZFhrg3QI5vjwdHElZGhwvkR0jk5WON4h6r25BSSHR_yCA1BT8jCCTUY-JK2UYkSPdOGcj5Q5e93kUPQYG7C9L7ibasTT-9DGiPvzt7i7-j69ehoDSy55YBMmry4KEBwfhHPXCVS--lenowynsUdKO-3sB0mDGCUA1dXaT_VwwUtgootJeDxG8qCECYdRGNbE-IMBZ9bQD7hxbtlGJcktZBxKwFWcIlYdrvnRpX7ZKSVZZRCEXcLMUCG3A&src-supplier=Texas+Instruments; ComponentLink2Description: https://octopart.com:443/opatz8j6/c1?t=F1xmG4FY8E4vrhjZrryjc23mCPIq81FSY47YbdUgzrOHKtatYtzBXjfTcUeFnRUOhXhk7ehRXLThSk6nTVP-yByxdkTK7GVS62bmswlM-KDnmEI1Oz3fC9QaPI8rEX43L1-nlQ88I0DH8vF85ZFhrg3QI5vjwdHElZGhwvkR0jk5WON4h6r25BSSHR_yCA1BT8jCCTUY-JK2UYkSPdOGcj5Q5e93kUPQYG7C9L7ibasTT-9DGiPvzt7i7-j69ehoDSy55YBMmry4KEBwfhHPXCVS--lenowynsUdKO-3sB0mDGCUA1dXaT_VwwUtgootJeDxG8qCECYdRGNbE-IMBZ9bQD7hxbtlGJcktZBxKwFWcIlYdrvnRpX7ZKSVZZRCEXcLMUCG3A&src-supplier=Texas+Instruments; ComponentLink3URL: https://datasheet.octopart.com:443/SN74AHC1G14DBVR-Texas-Instruments-datasheet-10899450.pdf?src-supplier=Texas+Instruments; ComponentLink3Description: https://datasheet.octopart.com:443/SN74AHC1G14DBVR-Texas-Instruments-datasheet-10899450.pdf?src-supplier=Texas+Instruments; ComponentLink4URL: https://sigma.octopart.com:443/175570406/technical_drawing/Texas-Instruments-SN74AHC1G14DBVR.pdf?src-supplier=Texas+Instruments; ComponentLink4Description: https://sigma.octopart.com:443/175570406/technical_drawing/Texas-Instruments-SN74AHC1G14DBVR.pdf?src-supplier=Texas+Instruments; ComponentLink5URL: https://sigma.octopart.com:443/169406034/technical_drawing/Texas-Instruments-SN74AHC1G14DBVR.pdf?src-supplier=Texas+Instruments; ComponentLink5Description: https://sigma.octopart.com:443/169406034/technical_drawing/Texas-Instruments-SN74AHC1G14DBVR.pdf?src-supplier=Texas+Instruments; ComponentLink6URL: https://sigma.octopart.com:443/155939316/technical_drawing/Texas-Instruments-SN74AHC1G14DBVR.pdf?src-supplier=Texas+Instruments; ComponentLink6Description: https://sigma.octopart.com:443/155939316/technical_drawing/Texas-Instruments-SN74AHC1G14DBVR.pdf?src-supplier=Texas+Instruments; ComponentLink7URL: https://sigma.octopart.com:443/102331370/technical_drawing/Texas-Instruments-SN74AHC1G14DBVR.pdf?src-supplier=Texas+Instruments; ComponentLink7Description: https://sigma.octopart.com:443/102331370/technical_drawing/Texas-Instruments-SN74AHC1G14DBVR.pdf?src-supplier=Texas+Instruments; ComponentLink8URL: https://sigma.octopart.com:443/49249325/technical_drawing/Texas-Instruments-SN74AHC1G14DBVR.pdf?src-supplier=Texas+Instruments; ComponentLink8Description: https://sigma.octopart.com:443/49249325/technical_drawing/Texas-Instruments-SN74AHC1G14DBVR.pdf?src-supplier=Texas+Instruments; ComponentLink9URL: https://datasheet.octopart.com:443/SN74AHC1G14DBVR-Texas-Instruments-datasheet-15540958.pdf?src-supplier=Texas+Instruments; ComponentLink9Description: https://datasheet.octopart.com:443/SN74AHC1G14DBVR-Texas-Instruments-datasheet-15540958.pdf?src-supplier=Texas+Instruments; ComponentLink10URL: https://datasheet.octopart.com:443/SN74AHC1G14DBVR-Texas-Instruments-datasheet-13398415.pdf?src-supplier=Texas+Instruments; ComponentLink10Description: https://datasheet.octopart.com:443/SN74AHC1G14DBVR-Texas-Instruments-datasheet-13398415.pdf?src-supplier=Texas+Instruments; ComponentLink11URL: https://datasheet.octopart.com:443/SN74AHC1G14DBVR-Texas-Instruments-datasheet-151459.pdf?src-supplier=Texas+Instruments; ComponentLink11Description: https://datasheet.octopart.com:443/SN74AHC1G14DBVR-Texas-Instruments-datasheet-151459.pdf?src-supplier=Texas+Instruments; ComponentLink12URL: https://datasheet.octopart.com:443/SN74AHC1G14DBVR-Texas-Instruments-datasheet-21076804.pdf?src-supplier=Upverter; ComponentLink12Description: https://datasheet.octopart.com:443/SN74AHC1G14DBVR-Texas-Instruments-datasheet-21076804.pdf?src-supplier=Upverter; ComponentLink13URL: https://datasheet.octopart.com:443/SN74AHC1G14DBVR-Texas-Instruments-datasheet-10839902.pdf?src-supplier=Farnell; ComponentLink13Description: https://datasheet.octopart.com:443/SN74AHC1G14DBVR-Texas-Instruments-datasheet-10839902.pdf?src-supplier=Farnell; ComponentLink14URL: https://datasheet.octopart.com:443/SN74AHC1G14DBVR-Texas-Instruments-datasheet-5327643.pdf?src-supplier=Farnell; ComponentLink14Description: https://datasheet.octopart.com:443/SN74AHC1G14DBVR-Texas-Instruments-datasheet-5327643.pdf?src-supplier=Farnell; ComponentLink15URL: https://datasheet.octopart.com:443/SN74AHC1G14DBVR-Texas-Instruments-datasheet-37140305.pdf?src-supplier=Farnell; ComponentLink15Description: https://datasheet.octopart.com:443/SN74AHC1G14DBVR-Texas-Instruments-datasheet-37140305.pdf?src-supplier=Farnell; ComponentLink16URL: https://datasheet.octopart.com:443/SN74AHC1G14DBVR-Texas-Instruments-datasheet-65713409.pdf?src-supplier=Farnell; ComponentLink16Description: https://datasheet.octopart.com:443/SN74AHC1G14DBVR-Texas-Instruments-datasheet-65713409.pdf?src-supplier=Farnell; ComponentLink17URL: https://datasheet.octopart.com:443/SN74AHC1G14DBVR.-Texas-Instruments-datasheet-62115943.pdf?src-supplier=Farnell; ComponentLink17Description: https://datasheet.octopart.com:443/SN74AHC1G14DBVR.-Texas-Instruments-datasheet-62115943.pdf?src-supplier=Farnell; ComponentLink18URL: https://datasheet.octopart.com:443/SN74AHC1G14DBVR-Texas-Instruments-datasheet-5312905.pdf?src-supplier=Farnell; ComponentLink18Description: https://datasheet.octopart.com:443/SN74AHC1G14DBVR-Texas-Instruments-datasheet-5312905.pdf?src-supplier=Farnell; ComponentLink19URL: https://datasheet.octopart.com:443/SN74AHC1G14DBVR-Texas-Instruments-datasheet-159115778.pdf?src-supplier=SHENGYU+ELECTRONICS; ComponentLink19Description: https://datasheet.octopart.com:443/SN74AHC1G14DBVR-Texas-Instruments-datasheet-159115778.pdf?src-supplier=SHENGYU+ELECTRONICS; ComponentLink20URL: https://datasheet.octopart.com:443/SN74AHC1G14DBVR-Texas-Instruments-datasheet-68643033.pdf?src-supplier=element14+APAC; ComponentLink20Description: https://datasheet.octopart.com:443/SN74AHC1G14DBVR-Texas-Instruments-datasheet-68643033.pdf?src-supplier=element14+APAC; ComponentLink21URL: https://datasheet.octopart.com:443/SN74AHC1G14DBVR-Texas-Instruments-datasheet-27379534.pdf?src-supplier=element14+APAC; ComponentLink21Description: https://datasheet.octopart.com:443/SN74AHC1G14DBVR-Texas-Instruments-datasheet-27379534.pdf?src-supplier=element14+APAC; ComponentLink22URL: https://datasheet.octopart.com:443/SN74AHC1G14DBVR-Texas-Instruments-datasheet-23714851.pdf?src-supplier=element14+APAC; ComponentLink22Description: https://datasheet.octopart.com:443/SN74AHC1G14DBVR-Texas-Instruments-datasheet-23714851.pdf?src-supplier=element14+APAC; ComponentLink23URL: https://datasheet.octopart.com:443/SN74AHC1G14DBVR-Texas-Instruments-datasheet-28728.pdf?src-supplier=Sierra+IC; ComponentLink23Description: https://datasheet.octopart.com:443/SN74AHC1G14DBVR-Texas-Instruments-datasheet-28728.pdf?src-supplier=Sierra+IC; ComponentLink24URL: https://datasheet.octopart.com:443/SN74AHC1G14DBVR-Texas-Instruments-datasheet-103118165.pdf?src-supplier=TME; ComponentLink24Description: https://datasheet.octopart.com:443/SN74AHC1G14DBVR-Texas-Instruments-datasheet-103118165.pdf?src-supplier=TME; ComponentLink25URL: https://datasheet.octopart.com:443/SN74AHC1G14DBVR-Texas-Instruments-datasheet-137316104.pdf?src-supplier=Future+Electronics; ComponentLink25Description: https://datasheet.octopart.com:443/SN74AHC1G14DBVR-Texas-Instruments-datasheet-137316104.pdf?src-supplier=Future+Electronics; ComponentLink26URL: https://datasheet.octopart.com:443/SN74AHC1G14DBVR-Texas-Instruments-datasheet-33018665.pdf?src-supplier=Newark; ComponentLink26Description: https://datasheet.octopart.com:443/SN74AHC1G14DBVR-Texas-Instruments-datasheet-33018665.pdf?src-supplier=Newark; ComponentLink27URL: https://datasheet.octopart.com:443/SN74AHC1G14DBVR-Texas-Instruments-datasheet-58796.pdf?src-supplier=Newark; ComponentLink27Description: https://datasheet.octopart.com:443/SN74AHC1G14DBVR-Texas-Instruments-datasheet-58796.pdf?src-supplier=Newark; ComponentLink28URL: https://datasheet.octopart.com:443/SN74AHC1G14DBVR-Texas-Instruments-datasheet-14147401.pdf?src-supplier=iiiC; ComponentLink28Description: https://datasheet.octopart.com:443/SN74AHC1G14DBVR-Texas-Instruments-datasheet-14147401.pdf?src-supplier=iiiC; ComponentLink29URL: https://datasheet.octopart.com:443/SN74AHC1G14DBVR-Texas-Instruments-datasheet-8443000.pdf?src-supplier=Jameco; ComponentLink29Description: https://datasheet.octopart.com:443/SN74AHC1G14DBVR-Texas-Instruments-datasheet-8443000.pdf?src-supplier=Jameco; ComponentLink30URL: http://sigma.octopart.com:80/reach_statement/Texas-Instruments-company-64.pdf?src-supplier=Compliance+Statements; ComponentLink30Description: http://sigma.octopart.com:80/reach_statement/Texas-Instruments-company-64.pdf?src-supplier=Compliance+Statements; ComponentLink31URL: http://sigma.octopart.com:80/conflict_mineral_statement/Texas-Instruments-company-63.pdf?src-supplier=Compliance+Statements; ComponentLink31Description: http://sigma.octopart.com:80/conflict_mineral_statement/Texas-Instruments-company-63.pdf?src-supplier=Compliance+Statements; LCSC Part Number: C7469
U16-U21 = BTN8982TAAUMA1: Half Bridge Driver DC Motors, General Purpose DMOS PG-TO263-7-1; Manufacturer: Infineon; Fault Protection: Over Temperature, Short Circuit; Interface: Logic; Max Junction Temperature (Tj): 150°C; Max Output current: 77A; Max Supply Current: 3.3mA; Max Supply Voltage: 18V; Min Supply Voltage: 8V; Nominal Supply Current: 2.2mA; Number of Channels: 1; Number of Outputs: 3; Operating Supply Voltage: 13.5V; Output Current per Channel: 50A; Output Voltage: 40V; Supplier: DigiKey; Supplier Part Number: BTN8982TAAUMA1INCT-ND; Manufacturer Part Number: BTN8982TAAUMA1; RoHS: Compliant; Category: Motor Drivers; Stock: 6617; Pricing: 1=5.61, 10=4.294, 25=3.964, 100=3.6016, 250=3.42872, 500=3.32452 (USD); Case/Package: TO-263-7; China RoHS: Non-Compliant; Halogen Free: Halogen Free; Height: 4.4mm; Height - Seated (Max): 4.5mm; Lead Free: Contains Lead; Length: 10mm; Lifecycle Status: Production; Max Operating Temperature: 150°C; Min Operating Temperature: -55°C; Mounting Technology: Surface Mount; Number of Circuits: 1; Pins: 7; Number of Terminals: 7; Number of Transmitters: 1; Operating Supply Current: 2.2mA; Package Quantity: 1000; Packaging: Tape & Reel; REACH SVHC: No; Schedule B: 8542390000, 8542390000|8542390000|8542390000|8542390000|8542390000; Terminal Pitch: 1.27mm; Width: 9.25mm; ComponentLink1URL: https://datasheet.octopart.com:443/BTN8982TAAUMA1-Infineon-datasheet-38586438.pdf?src-supplier=Farnell; ComponentLink1Description: https://datasheet.octopart.com:443/BTN8982TAAUMA1-Infineon-datasheet-38586438.pdf?src-supplier=Farnell; ComponentLink2URL: https://datasheet.octopart.com:443/BTN8982TAAUMA1-Infineon-datasheet-163654640.pdf?src-supplier=SHENGYU+ELECTRONICS; ComponentLink2Description: https://datasheet.octopart.com:443/BTN8982TAAUMA1-Infineon-datasheet-163654640.pdf?src-supplier=SHENGYU+ELECTRONICS; ComponentLink3URL: http://sigma.octopart.com:80/conflict_mineral_statement/Infineon-company-51.pdf?src-supplier=Compliance+Statements; ComponentLink3Description: http://sigma.octopart.com:80/conflict_mineral_statement/Infineon-company-51.pdf?src-supplier=Compliance+Statements; LCSC Part Number: C112630
U24 = IPD90P03P4L04ATMA2: MOSFET P-CH 30V 90A TO252-31 P-Channel 30 V 90A (Tc) 137W (Tc) Surface Mount PG-TO252-3-11; Manufacturer: Infineon; Drain to Source Resistance: 6.8mΩ; Number of Elements: 1; Supplier: DigiKey; Supplier Part Number: 448-IPD90P03P4L04ATMA2CT-ND; Manufacturer Part Number: IPD90P03P4L04ATMA2; RoHS: Compliant; Category: MOSFETs; Stock: 5027; Pricing: 1=2.64, 10=1.702, 100=1.1675, 500=0.94064 (USD); China RoHS: Non-Compliant; Continuous Drain Current (ID): 90A; Lifecycle Status: Production; Max Operating Temperature: 175°C; Max Power Dissipation: 137W; Min Breakdown Voltage: 30V; Min Operating Temperature: -55°C; Number of Terminals: 2; REACH SVHC: No; ComponentLink1URL: https://datasheet.octopart.com:443/IPD90P03P4L04ATMA2-Infineon-datasheet-27843954.pdf?src-supplier=IHS; ComponentLink1Description: https://datasheet.octopart.com:443/IPD90P03P4L04ATMA2-Infineon-datasheet-27843954.pdf?src-supplier=IHS; ComponentLink2URL: http://sigma.octopart.com:80/conflict_mineral_statement/Infineon-company-51.pdf?src-supplier=Compliance+Statements; ComponentLink2Description: http://sigma.octopart.com:80/conflict_mineral_statement/Infineon-company-51.pdf?src-supplier=Compliance+Statements; LCSC Part Number: C148284
U25 = RA-02: RF TXRX MOD ISM<1GHZIPEX SMD; Manufacturer: Ai-Thinker; Supplier: Digikey; Supplier Part Number: 4570-RA-02CT-ND; Manufacturer Part Number: RA-02; RoHS: No; Category: LDO; Stock: 18; Pricing: 1=6.75, 10=5.85, 25=5.5364 (USD); LCSC Part Number: C90039